# Altium project Kasli-SOC.PrjPcb (part 2 of 11)

## Sheet Kasli-SOC_power.SchDoc: SOC
size 420 x 297 mm; Projet: FPGA & ARM SoC FMC Carrier; CheckedBy: G.Kasprowicz; Author: F.Switakowski; CompanyName: WUT ISE; DrawnBy: F.Switakowski; Organization: WUT ISE; Address1: PW ISE; Address2: Nowowiejska 15/19 00-665 Warsaw; Address3: gkasprow@gmail.com; DocumentNumber: 18; Revision: 1; SheetNumber: 18; SheetTotal: 18; ModifiedBy: -; CheckedDate: -; Title2: Power & Caps; DivGrp: WUT ISE; Designer: G.Kasprowicz; ModifiedDate: -; ProjectName: Sensor Box
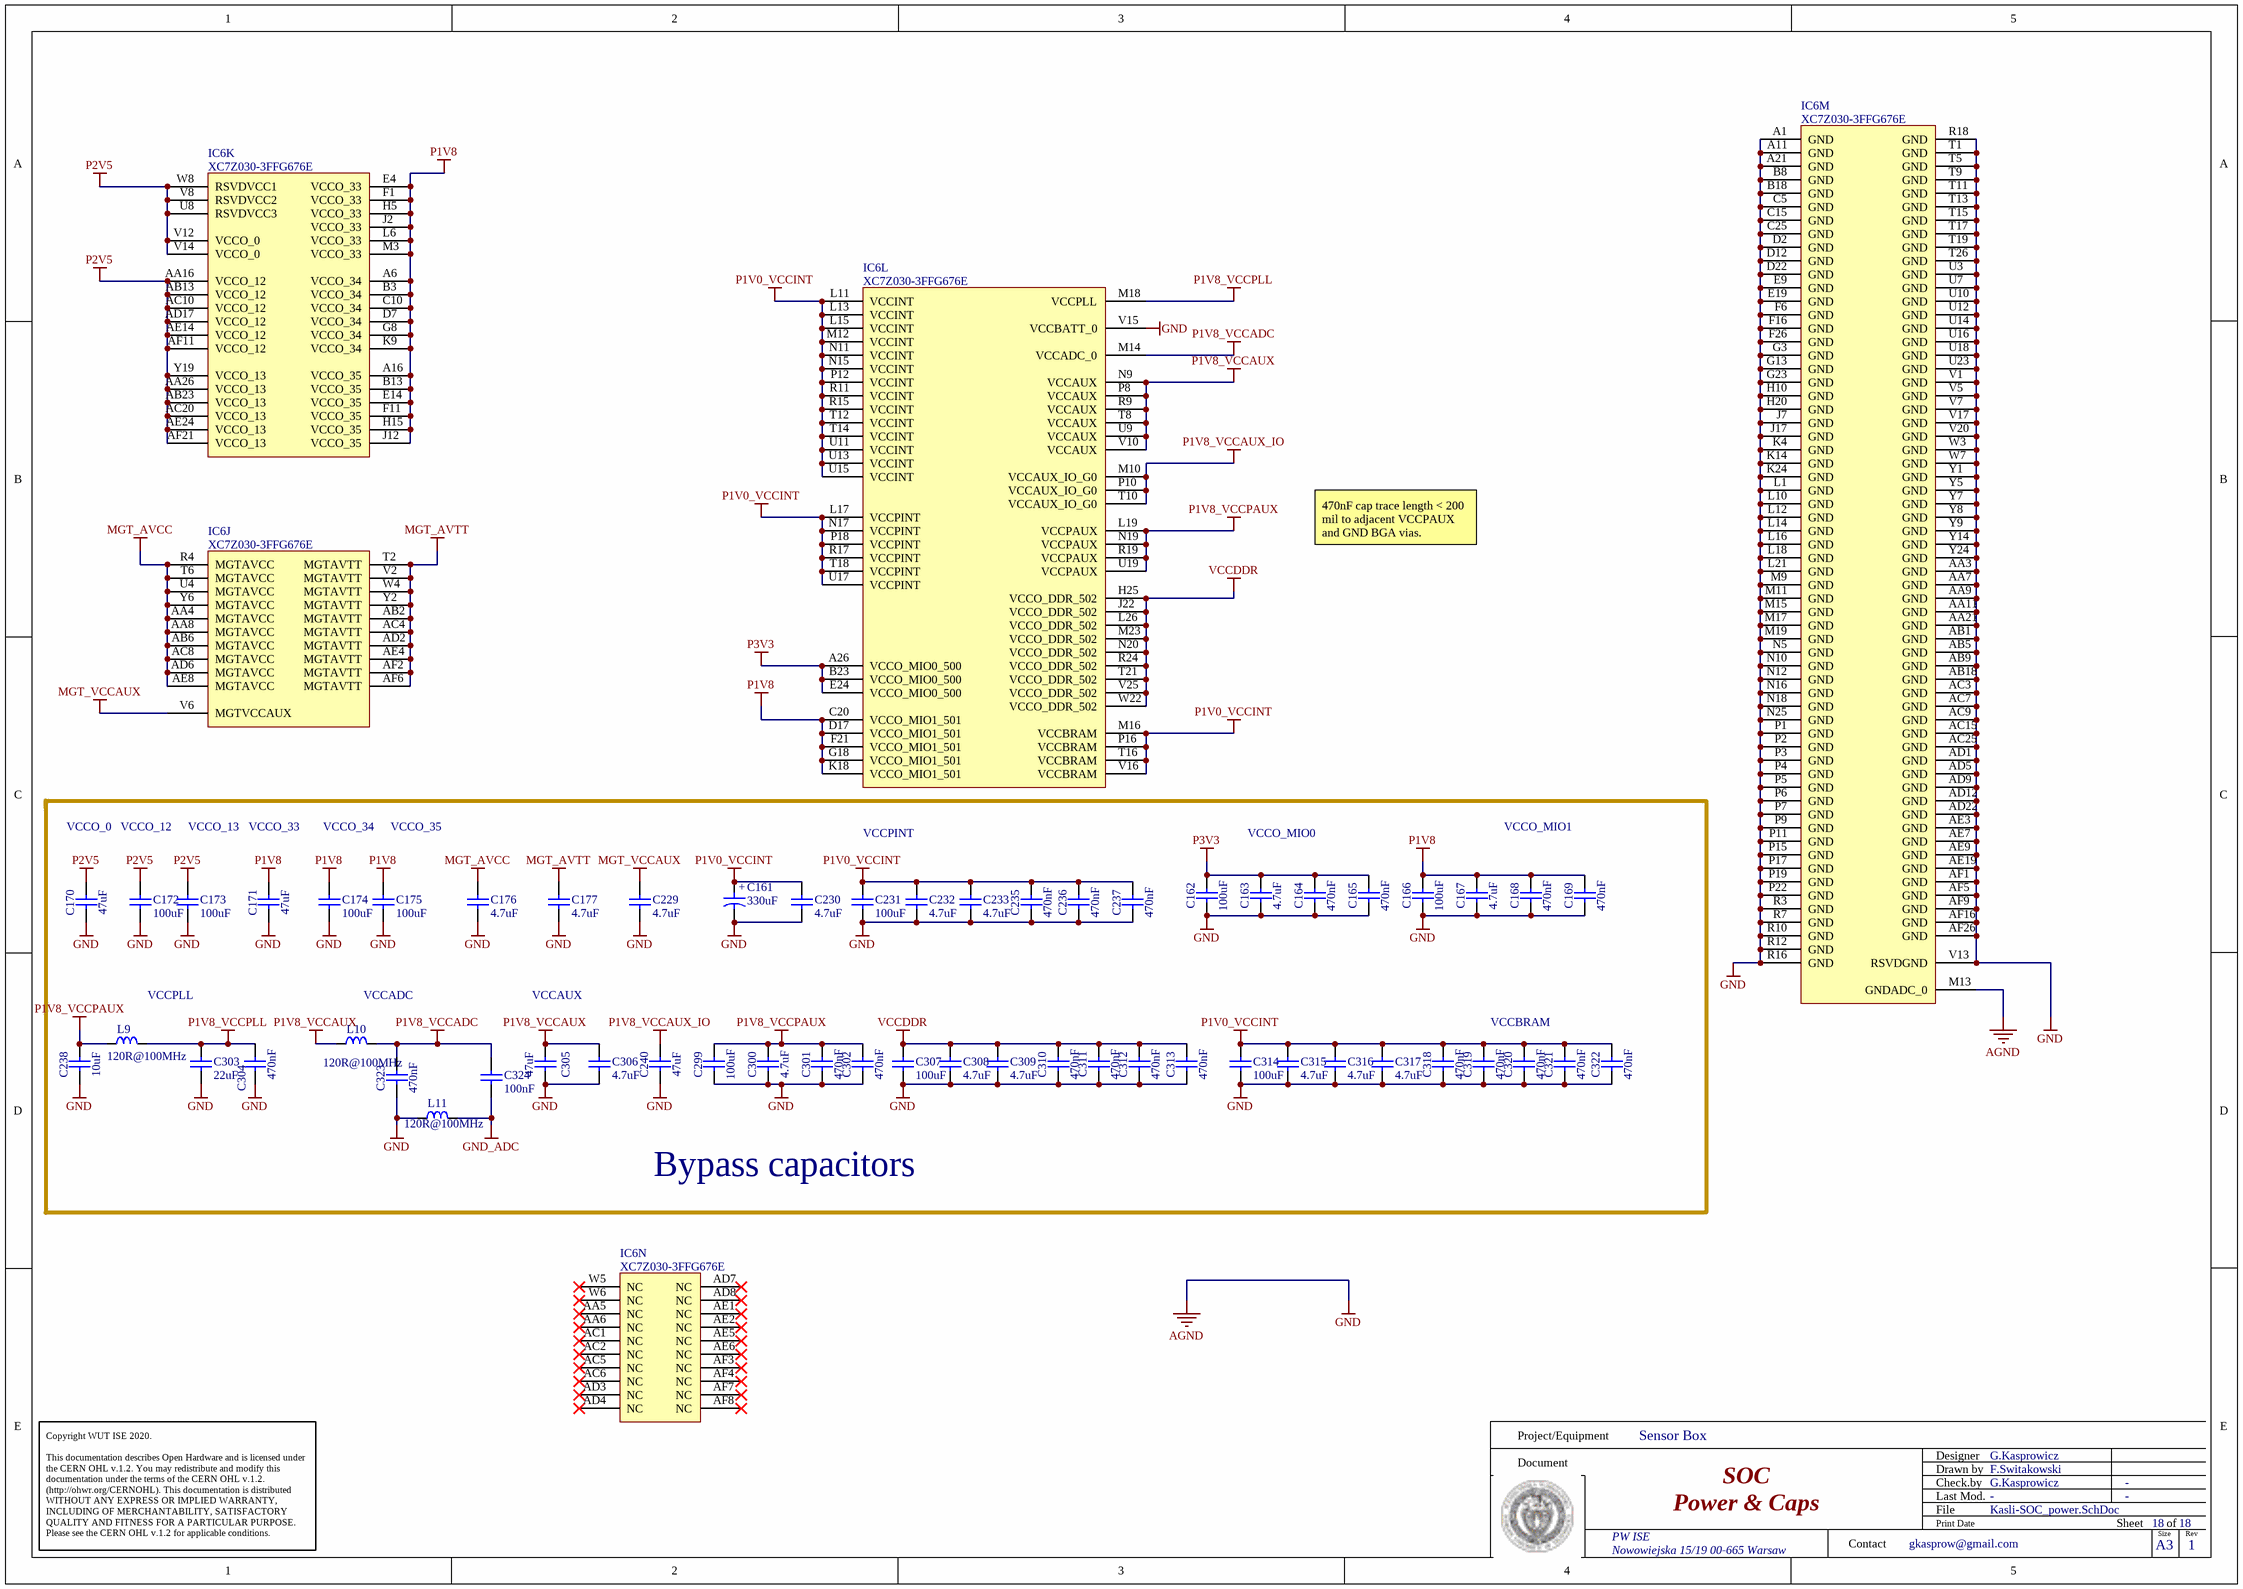
[diagram p3: Kasli-SOC_power.SchDoc]

### Parts
C161  value 330uF  [CAPMP7343X310N]  (hidden comment: 330uF/6.3V/30mR)
C162  100uF  [CAPC3216X180N]
C163  4.7uF  [CAPC1005X55N]
C164  470nF  [CAPC1005X55N]
C165  470nF  [CAPC1005X55N]
C166  100uF  [CAPC3216X180N]
C167  4.7uF  [CAPC1005X55N]
C168  470nF  [CAPC1005X55N]
C169  470nF  [CAPC1005X55N]
C170  47uF  [CAPC3216X180N]
C171  47uF  [CAPC3216X180N]
C172  100uF  [CAPC3216X180N]
C173  100uF  [CAPC3216X180N]
C174  100uF  [CAPC3216X180N]
C175  100uF  [CAPC3216X180N]
C176  4.7uF  [CAPC1608X87N]
C177  4.7uF  [CAPC1608X87N]
C229  4.7uF  [CAPC1608X87N]
C230  4.7uF  [CAPC1608X87N]
C231  100uF  [CAPC3216X180N]
C232  4.7uF  [CAPC1608X87N]
C233  4.7uF  [CAPC1608X87N]
C235  470nF  [CAPC1005X55N]
C236  470nF  [CAPC1005X55N]
C237  470nF  [CAPC1005X55N]
C238  10uF  [CAPC1005X70N]
C240  47uF  [CAPC3216X180N]
C299  100uF  [CAPC3216X180N]
C300  4.7uF  [CAPC1005X55N]
C301  470nF  [CAPC1005X55N]
C302  470nF  [CAPC1005X55N]
C303  22uF  [CAPC3216X180N]
C304  470nF  [CAPC1005X55N]
C305  47uF  [CAPC3216X180N]
C306  4.7uF  [CAPC1608X87N]
C307  100uF  [CAPC3216X180N]
C308  4.7uF  [CAPC1608X87N]
C309  4.7uF  [CAPC1608X87N]
C310  470nF  [CAPC1005X55N]
C311  470nF  [CAPC1005X55N]
C312  470nF  [CAPC1005X55N]
C313  470nF  [CAPC1005X55N]
C314  100uF  [CAPC3216X180N]
C315  4.7uF  [CAPC1608X87N]
C316  4.7uF  [CAPC1608X87N]
C317  4.7uF  [CAPC1608X87N]
C318  470nF  [CAPC1005X55N]
C319  470nF  [CAPC1005X55N]
C320  470nF  [CAPC1005X55N]
C321  470nF  [CAPC1005X55N]
C322  470nF  [CAPC1005X55N]
C323  470nF  [CAPC1005X55N]
C324  100nF  [CAPC1005X55N]
IC6  XC7Z030-3FFG676E  [BGA676C100P26X26_2700X2700X324]  (parts J,K,L,M,N of 14)
L9  120R@100MHz  [INDC1005X55N]
L10  120R@100MHz  [INDC1005X55N]
L11  120R@100MHz  [INDC1005X55N]

### Nets
GND: C161.2 C162.1 C163.1 C164.1 C165.1 C166.1 C167.1 C168.1 C169.1 C170.1 C171.1 C172.2 C173.2 C174.2 C175.2 C176.1 C177.1 C229.1 C230.1 C231.2 C232.1 C233.1 C235.1 C236.1 C237.1 C238.1 C240.1 C299.1 C300.1 C301.1 C302.1 C303.2 C304.1 C305.2 C306.1 C307.2 C308.1 C309.1 C310.1 C311.1 C312.1 C313.1 C314.2 C315.1 C316.1 C317.1 C318.1 C319.1 C320.1 C321.1 C322.1 C323.1 IC6.A1(GND) IC6.A11(GND) IC6.A21(GND) IC6.AA3(GND) IC6.AA7(GND) IC6.AA9(GND) IC6.AA11(GND) IC6.AA21(GND) IC6.AB1(GND) IC6.AB5(GND) IC6.AB9(GND) IC6.AB18(GND) IC6.AC3(GND) IC6.AC7(GND) IC6.AC9(GND) IC6.AC15(GND) IC6.AC25(GND) IC6.AD1(GND) IC6.AD5(GND) IC6.AD9(GND) IC6.AD12(GND) IC6.AD22(GND) IC6.AE3(GND) IC6.AE7(GND) IC6.AE9(GND) IC6.AE19(GND) IC6.AF1(GND) IC6.AF5(GND) IC6.AF9(GND) IC6.AF16(GND) IC6.AF26(GND) IC6.B8(GND) IC6.B18(GND) IC6.C5(GND) IC6.C15(GND) IC6.C25(GND) IC6.D2(GND) IC6.D12(GND) IC6.D22(GND) IC6.E9(GND) IC6.E19(GND) IC6.F6(GND) IC6.F16(GND) IC6.F26(GND) IC6.G3(GND) IC6.G13(GND) IC6.G23(GND) IC6.H10(GND) IC6.H20(GND) IC6.J7(GND) IC6.J17(GND) IC6.K4(GND) IC6.K14(GND) IC6.K24(GND) IC6.L1(GND) IC6.L10(GND) IC6.L12(GND) IC6.L14(GND) IC6.L16(GND) IC6.L18(GND) IC6.L21(GND) IC6.M9(GND) IC6.M11(GND) IC6.M13(GNDADC_0) IC6.M15(GND) IC6.M17(GND) IC6.M19(GND) IC6.N5(GND) IC6.N10(GND) IC6.N12(GND) IC6.N16(GND) IC6.N18(GND) IC6.N25(GND) IC6.P1(GND) IC6.P2(GND) IC6.P3(GND) IC6.P4(GND) IC6.P5(GND) IC6.P6(GND) IC6.P7(GND) IC6.P9(GND) IC6.P11(GND) IC6.P15(GND) IC6.P17(GND) IC6.P19(GND) IC6.P22(GND) IC6.R3(GND) IC6.R7(GND) IC6.R10(GND) IC6.R12(GND) IC6.R16(GND) IC6.R18(GND) IC6.T1(GND) IC6.T5(GND) IC6.T9(GND) IC6.T11(GND) IC6.T13(GND) IC6.T15(GND) IC6.T17(GND) IC6.T19(GND) IC6.T26(GND) IC6.U3(GND) IC6.U7(GND) IC6.U10(GND) IC6.U12(GND) IC6.U14(GND) IC6.U16(GND) IC6.U18(GND) IC6.U23(GND) IC6.V1(GND) IC6.V5(GND) IC6.V7(GND) IC6.V13(RSVDGND) IC6.V15(VCCBATT_0) IC6.V17(GND) IC6.V20(GND) IC6.W3(GND) IC6.W7(GND) IC6.Y1(GND) IC6.Y5(GND) IC6.Y7(GND) IC6.Y8(GND) IC6.Y9(GND) IC6.Y14(GND) IC6.Y24(GND) L11.1  [also labelled AGND]
GND_ADC: C324.1 L11.2
MGT_AVCC: C176.2 IC6.AA4(MGTAVCC) IC6.AA8(MGTAVCC) IC6.AB6(MGTAVCC) IC6.AC8(MGTAVCC) IC6.AD6(MGTAVCC) IC6.AE8(MGTAVCC) IC6.R4(MGTAVCC) IC6.T6(MGTAVCC) IC6.U4(MGTAVCC) IC6.Y6(MGTAVCC)
MGT_AVTT: C177.2 IC6.AB2(MGTAVTT) IC6.AC4(MGTAVTT) IC6.AD2(MGTAVTT) IC6.AE4(MGTAVTT) IC6.AF2(MGTAVTT) IC6.AF6(MGTAVTT) IC6.T2(MGTAVTT) IC6.V2(MGTAVTT) IC6.W4(MGTAVTT) IC6.Y2(MGTAVTT)
MGT_VCCAUX: C229.2 IC6.V6(MGTVCCAUX)
P1V0_VCCINT: C161.1 C230.2 C231.1 C232.2 C233.2 C235.2 C236.2 C237.2 C314.1 C315.2 C316.2 C317.2 C318.2 C319.2 C320.2 C321.2 C322.2 IC6.L11(VCCINT) IC6.L13(VCCINT) IC6.L15(VCCINT) IC6.L17(VCCPINT) IC6.M12(VCCINT) IC6.M16(VCCBRAM) IC6.N11(VCCINT) IC6.N15(VCCINT) IC6.N17(VCCPINT) IC6.P12(VCCINT) IC6.P16(VCCBRAM) IC6.P18(VCCPINT) IC6.R11(VCCINT) IC6.R15(VCCINT) IC6.R17(VCCPINT) IC6.T12(VCCINT) IC6.T14(VCCINT) IC6.T16(VCCBRAM) IC6.T18(VCCPINT) IC6.U11(VCCINT) IC6.U13(VCCINT) IC6.U15(VCCINT) IC6.U17(VCCPINT) IC6.V16(VCCBRAM)
P1V8: C166.2 C167.2 C168.2 C169.2 C171.2 C174.1 C175.1 IC6.A6(VCCO_34) IC6.A16(VCCO_35) IC6.B3(VCCO_34) IC6.B13(VCCO_35) IC6.C10(VCCO_34) IC6.C20(VCCO_MIO1_501) IC6.D7(VCCO_34) IC6.D17(VCCO_MIO1_501) IC6.E4(VCCO_33) IC6.E14(VCCO_35) IC6.F1(VCCO_33) IC6.F11(VCCO_35) IC6.F21(VCCO_MIO1_501) IC6.G8(VCCO_34) IC6.G18(VCCO_MIO1_501) IC6.H5(VCCO_33) IC6.H15(VCCO_35) IC6.J2(VCCO_33) IC6.J12(VCCO_35) IC6.K9(VCCO_34) IC6.K18(VCCO_MIO1_501) IC6.L6(VCCO_33) IC6.M3(VCCO_33)
P1V8_VCCADC: C323.2 C324.2 IC6.M14(VCCADC_0) L10.2
P1V8_VCCAUX: C305.1 C306.2 IC6.N9(VCCAUX) IC6.P8(VCCAUX) IC6.R9(VCCAUX) IC6.T8(VCCAUX) IC6.U9(VCCAUX) IC6.V10(VCCAUX) L10.1
P1V8_VCCAUX_IO: C240.2 IC6.M10(VCCAUX_IO_G0) IC6.P10(VCCAUX_IO_G0) IC6.T10(VCCAUX_IO_G0)
P1V8_VCCPAUX: C238.2 C299.2 C300.2 C301.2 C302.2 IC6.L19(VCCPAUX) IC6.N19(VCCPAUX) IC6.R19(VCCPAUX) IC6.U19(VCCPAUX) L9.1
P1V8_VCCPLL: C303.1 C304.2 IC6.M18(VCCPLL) L9.2
P2V5: C170.2 C172.1 C173.1 IC6.AA16(VCCO_12) IC6.AA26(VCCO_13) IC6.AB13(VCCO_12) IC6.AB23(VCCO_13) IC6.AC10(VCCO_12) IC6.AC20(VCCO_13) IC6.AD17(VCCO_12) IC6.AE14(VCCO_12) IC6.AE24(VCCO_13) IC6.AF11(VCCO_12) IC6.AF21(VCCO_13) IC6.U8(RSVDVCC3) IC6.V8(RSVDVCC2) IC6.V12(VCCO_0) IC6.V14(VCCO_0) IC6.W8(RSVDVCC1) IC6.Y19(VCCO_13)
P3V3: C162.2 C163.2 C164.2 C165.2 IC6.A26(VCCO_MIO0_500) IC6.B23(VCCO_MIO0_500) IC6.E24(VCCO_MIO0_500)
VCCDDR: C307.1 C308.2 C309.2 C310.2 C311.2 C312.2 C313.2 IC6.H25(VCCO_DDR_502) IC6.J22(VCCO_DDR_502) IC6.L26(VCCO_DDR_502) IC6.M23(VCCO_DDR_502) IC6.N20(VCCO_DDR_502) IC6.R24(VCCO_DDR_502) IC6.T21(VCCO_DDR_502) IC6.V25(VCCO_DDR_502) IC6.W22(VCCO_DDR_502)

Not connected (* = marked no-connect by the designer): IC6 AA5(NC)* AA6(NC)* AC1(NC)* AC2(NC)* AC5(NC)* AC6(NC)* AD3(NC)* AD4(NC)* AD7(NC)* AD8(NC)* AE1(NC)* AE2(NC)* AE5(NC)* AE6(NC)* AF3(NC)* AF4(NC)* AF7(NC)* AF8(NC)* W5(NC)* W6(NC)*

### Notes on the sheet
- 470nF cap trace length < 200 mil to adjacent VCCPAUX and GND BGA vias.
- VCCO_0
- VCCO_12
- VCCO_13
- VCCO_33
- VCCO_34
- VCCO_35
- VCCPINT
- VCCO_MIO0
- VCCO_MIO1
- VCCPLL
- (near L10) VCCADC
- VCCAUX
- VCCBRAM
- Bypass capacitors
- Project/Equipment
- Document
- Designer
- Drawn by
- Check.by
- Copyright WUT ISE 2020.
  This documentation describes Open Hardware and is licensed under the CERN OHL v.1.2. You may redistribute and modify this documentation under the terms of the CERN OHL v.1.2. (http://ohwr.org/CERNOHL). This documentation is distributed WITHOUT ANY EXPRESS OR IMPLIED WARRANTY, INCLUDING OF MERCHANTABILITY, SATISFACTORY QUALITY AND FITNESS FOR A PARTICULAR PURPOSE. Please see the CERN OHL v.1.2 for applicable conditions.
- Contact
- File
- Last Mod.
- Print Date
- Sheet
- Size
- A3
- of
- Rev
- (in symbol CTE7343-31_330UF_6.3V_20%_LESR0015_KEMET_T520) +

### Library data of the parts
C161 = CTE7343-31_330UF_6.3V_20%_LESR0015_KEMET_T520: Polarised capacitor; Part Description: Low ESR 0R015 Tantalum Chip Capacitor; Manufacturer: KEMET; Manufacturer Part Number: T520D337M006ATE015; Voltage: 6.3V; Tolerance: ±20%; Table: Capacitors SMD; Part Number: CTE7343-31_330UF_6.3V_20%_LESR0015_KEMET_T520; Component Kind: Standard; Component Type: Standard; Pin Count: 2; Status: None; Case: D; Mounted: Yes; Socket: No; SMD: Yes; ComponentHeight: 3.1mm; HelpURL: \\cern.ch\dfs\Applications\Altium\Datasheets\CTE-LESR_KEMET_T520.pdf; Author: CERN DEM JLC; CreateDate: 2012-01-11; LatestRevisionDate: 2012-01-11
C162 C166 C299 = CC1206_100UF_6.3V_20%_X5R: Non-polarised capacitor; Part Description: SMD Multilayer Chip Ceramic Capacitor; Manufacturer: GENERIC; Manufacturer1 Part Number: C1206C107M9PACTU; Voltage: 6.3V; TC: X5R; Tolerance: ±10%; Part Number: CC1206_100UF_6.3V_20%_X5R; Component Kind: Standard; Component Type: Standard; Pin Count: 2; Value: 100uF; Status: None; Manufacturer Part Number: CC1206_100UF_6.3V_20%_X5R; Case: 1206; Mounted: Yes; Socket: No; SMD: Yes; Sense: No; Manufacturer1 Example: KEMET; Manufacturer1 ComponentHeight: 1.8mm; HelpURL: \\cern.ch\dfs\Applications\Altium\Datasheets\CC1206_X5R_KEMET.pdf; Author: CERN DEM JLC; CreateDate: 26/09/2012; LatestRevisionDate: 26/09/2012
C163 C167 C300 = CC0402_4.7UF_6.3V_20%_X5R: Non-polarised capacitor; Part Description: SMD Multilayer Chip Ceramic Capacitor; Manufacturer: GENERIC; Manufacturer1 Part Number: C1005X5R0J475M050BC; Voltage: 6.3V; TC: X5R; Tolerance: ±20%; Part Number: CC0402_4.7UF_6.3V_20%_X5R; Component Kind: Standard; Component Type: Standard; Pin Count: 2; Value: 4.7uF; Status: Preferred; Manufacturer Part Number: CC0402_4.7UF_6.3V_20%_X5R; Case: 0402; Mounted: Yes; Socket: No; SMD: Yes; Sense: No; Manufacturer1 Example: TDK; Manufacturer1 ComponentHeight: 0.65mm; HelpURL: \\cern.ch\dfs\Applications\Altium\Datasheets\CC0402_X5R_TDK_C.pdf; Author: CERN DEM JLC; CreateDate: 03/03/2015; LatestRevisionDate: 03/03/2015
C164 C165 C168 C169 C235-C237 C301 C302 C304 C310-C313 C318-C323 = CC0402_470NF_16V_10%_X5R: Non-polarised capacitor; Part Description: SMD Multilayer Chip Ceramic Capacitor; Manufacturer: GENERIC; Manufacturer1 Part Number: C1005X5R1C105KT; Voltage: 16V; TC: X5R; Tolerance: ±10%; Part Number: CC0402_470NF_16V_10%_X5R; Component Kind: Standard; Component Type: Standard; Pin Count: 2; Value: 470nF; Status: Preferred; Manufacturer Part Number: CC0402_470NF_16V_10%_X5R; Case: 0402; Mounted: Yes; Socket: No; SMD: Yes; Sense: No; Manufacturer1 Example: TDK; Manufacturer1 ComponentHeight: 0.55mm; HelpURL: \\cern.ch\dfs\Applications\Altium\Datasheets\CC0402_X5R_TDK_C.pdf; Author: CERN DEM JLC; CreateDate: 10/25/2012; LatestRevisionDate: 10/25/2012
C170 C171 C240 C305 = CC1206_47UF_10V_10%_X5R: Non-polarised capacitor; Part Description: SMD Multilayer Chip Ceramic Capacitor; Manufacturer: GENERIC; Manufacturer1 Part Number: GRM31CR61A476KE15; Voltage: 10V; TC: X5R; Tolerance: ±10%; Part Number: CC1206_47UF_10V_10%_X5R; Component Kind: Standard; Component Type: Standard; Pin Count: 2; Value: 47uF; Status: None; Manufacturer Part Number: CC1206_47UF_10V_10%_X5R; Case: 1206; Mounted: Yes; Socket: No; SMD: Yes; Sense: No; Manufacturer1 Example: MURATA; Manufacturer1 ComponentHeight: 1.8mm; HelpURL: \\cern.ch\dfs\Applications\Altium\Datasheets\CC1206_X5R_MURATA_GRM.pdf; Author: CERN DEM MR; CreateDate: 24/06/2016; LatestRevisionDate: 24/06/2016
C172-C175 C231 C307 C314 = CC1206_100UF_6.3V_20%_X5R: Non-polarised capacitor; Part Description: SMD Multilayer Chip Ceramic Capacitor; Manufacturer: GENERIC; Manufacturer1 Part Number: C1206C107M9PACTU; Voltage: 6.3V; TC: X5R; Tolerance: ±10%; Table: Capacitors SMD; Part Number: CC1206_100UF_6.3V_20%_X5R; Component Kind: Standard; Component Type: Standard; Pin Count: 2; Value: 100uF; Status: None; Manufacturer Part Number: CC1206_100UF_6.3V_20%_X5R; Case: 1206; Mounted: Yes; Socket: No; SMD: Yes; Manufacturer1 Example: KEMET; Manufacturer1 ComponentHeight: 1.8mm; HelpURL: \\cern.ch\dfs\Applications\Altium\Datasheets\CC1206_X5R_KEMET.pdf; Author: CERN DEM JLC; CreateDate: 2012-09-26; LatestRevisionDate: 2012-09-26
C176 C177 C229 C230 C232 C233 C306 C308 C309 C315-C317 = CC0603_4.7UF_6.3V_10%_X5R: Non-polarised capacitor; Part Description: SMD Multilayer Chip Ceramic Capacitor; Manufacturer: GENERIC; Manufacturer1 Part Number: 225520613672; Voltage: 6.3V; TC: X5R; Tolerance: ±10%; Table: Capacitors SMD; Part Number: CC0603_4.7UF_6.3V_10%_X5R; Component Kind: Standard; Component Type: Standard; Pin Count: 2; Value: 4.7uF; Status: Preferred; Manufacturer Part Number: CC0603_4.7uF_6.3V_10%_X5R; Case: 0603; Mounted: Yes; Socket: No; SMD: Yes; Manufacturer1 Example: PHYCOMP; Manufacturer1 ComponentHeight: 0.87mm; HelpURL: \\cern.ch\dfs\Applications\Altium\Datasheets\CC0805_X5R_PHYCOMP_HC.pdf; Author: CERN DEM JLC; CreateDate: 2007-12-03; LatestRevisionDate: 2007-12-03
C238 = CC0402_10UF_6.3V_20%_X5R: Non-polarised capacitor; Part Description: SMD Multilayer Chip Ceramic Capacitor; Manufacturer: GENERIC; Manufacturer1 Part Number: C1005X5R0J106M050BC; Voltage: 6.3V; TC: X5R; Tolerance: ±10%; Part Number: CC0402_10UF_6.3V_20%_X5R; Component Kind: Standard; Component Type: Standard; Pin Count: 2; Value: 10uF; Status: Preferred; Manufacturer Part Number: CC0402_10UF_6.3V_20%_X5R; Case: 0402; Mounted: Yes; Socket: No; SMD: Yes; Sense: No; Manufacturer1 Example: TDK; Manufacturer1 ComponentHeight: 0.70mm; HelpURL: \\cern.ch\dfs\Applications\Altium\Datasheets\CC0402_X5R_TDK_C.pdf; Author: CERN DEM JLC; CreateDate: 07.01.2015; LatestRevisionDate: 07.01.2015
C303 = CC1206_22UF_10V_10%_X7R: Non-polarised capacitor; Part Description: SMD Multilayer Chip Ceramic Capacitor; Manufacturer: GENERIC; Manufacturer1 Part Number: GRM31CR71A226KE15L; Voltage: 10V; TC: X7R; Tolerance: ±10%; Table: Capacitors SMD; Value: 22uF; Part Number: CC1206_22UF_10V_10%_X7R; Component Kind: Standard; Component Type: Standard; Pin Count: 2; Status: Preferred; Manufacturer Part Number: CC1206_22UF_10V_10%_X7R; Case: 1206; Mounted: Yes; Socket: No; SMD: Yes; Manufacturer1 Example: MURATA; Manufacturer1 ComponentHeight: 1.8mm; HelpURL: \\cern.ch\dfs\Applications\Altium\Datasheets\CC1206_X7R_MURATA_GRM-HI-CAP.pdf; Author: CERN DEM JLC; CreateDate: 2010-06-08; LatestRevisionDate: 2010-06-08
C324 = CC0402_100NF_16V_10%_X7R: Non-polarised capacitor; Part Description: SMD Multilayer Chip Ceramic Capacitor; Manufacturer: GENERIC; Manufacturer1 Part Number: GRM155R71C104KA88D; Voltage: 16V; TC: X7R; Tolerance: ±10%; Table: Capacitors SMD; Part Number: CC0402_100NF_16V_10%_X7R; Component Kind: Standard; Component Type: Standard; Pin Count: 2; Value: 100nF; Status: Not Recommended; Manufacturer Part Number: CC0402_100NF_16V_10%_X7R; Case: 0402; Mounted: Yes; Socket: No; SMD: Yes; Manufacturer1 Example: MURATA; Manufacturer1 ComponentHeight: 0.55mm; HelpURL: \\cern.ch\dfs\Applications\Altium\Datasheets\CC0402_X7R_MURATA_GRM.pdf; Author: CERN DEM JLC; CreateDate: 2013-12-05; LatestRevisionDate: 2007-12-03
IC6 = XC7Z030-2FFG676I: 733 MHz Zynq™-7000 AP SoC, 130 PS I/O, 254 FPGA I/O, 676-Ball BGA, Speed Grade 2, Industrial Grade, Pb-Free; Part Description: Zynq™-7000 All Programmable SoC, Dual-core ARM® Cortex™-A9 CPU, 676-Ball BGA, Speed Grade 2, Industrial Grade, Pb-Free; Manufacturer: XILINX; PressFit: No; Bonding: No; Part Number: XC7Z030-3FFG676E; Component Kind: Standard; Component Type: Standard; Device: XC7Z030-2FFG676I; PackageDescription: BGA, 1.00mm Pitch, Square; 676 Pin, 26 Columns X 26 Rows, 27.00mm X 27.00mm X 2.60mm H; Manufacturer Part Number: XC7Z030-3FFG676E; Pin Count: 676; Case: BGA676; Mounted: Yes; Socket: No; SMD: Yes; Sense: No; ComponentHeight: 3.24mm; HelpURL: \\cern.ch\dfs\Applications\Altium\Datasheets\XC7Z030-2FFG676I.pdf; ComponentLink1URL: \\cern.ch\dfs\Applications\Altium\Datasheets\XC7Z030-2FFG676I_Package.pdf; ComponentLink1Description: Package; ComponentLink2URL: \\cern.ch\dfs\Applications\Altium\Datasheets\XC7Z030-2FFG676I_Pinout.txt; ComponentLink2Description: Pinout; Author: CERN DEM JLC; CreateDate: 29/04/2014; LatestRevisionDate: 29/04/2014
L9-L11 = IND0402_MURATA_BLM15PX121SN1D: Inductor; Part Description: SMD EMIFIL Chip Ferrite Bead; Manufacturer: MURATA; Power: 2A; Resistance: 0.055R; Tolerance: ±25%; Table: Inductors SMD; Part Number: IND0402_MURATA_BLM15PX121SN1D; Component Kind: Standard; Component Type: Standard; Pin Count: 2; Value: 120R@100MHz; Status: None; Manufacturer Part Number: BLM15PX121SN1D; Case: 0402; Mounted: Yes; Socket: No; SMD: Yes; ComponentHeight: 0.55mm; HelpURL: \\cern.ch\dfs\Applications\Altium\Datasheets\IND0402_MURATA_BLM15PX.pdf; Author: CERN DEM JMW; CreateDate: 2014-02-19; LatestRevisionDate: 2014-02-19

## Sheet Kasli-SOC_bank112.SchDoc: MGT
size 420 x 297 mm; CheckedBy: G.Kasprowicz; Author: F.Switakowski; CompanyName: WUT ISE; DrawnBy: F.Switakowski; Organization: WUT ISE; Address1: PW ISE; Address2: Nowowiejska 15/19 00-665 Warsaw; Address3: gkasprow@gmail.com; DocumentNumber: 5; Revision: 1; SheetNumber: 5; SheetTotal: 18; ModifiedBy: -; CheckedDate: -; Title2: & clock; DivGrp: WUT ISE; Designer: G.Kasprowicz; ModifiedDate: -; ProjectName: Sensor Box
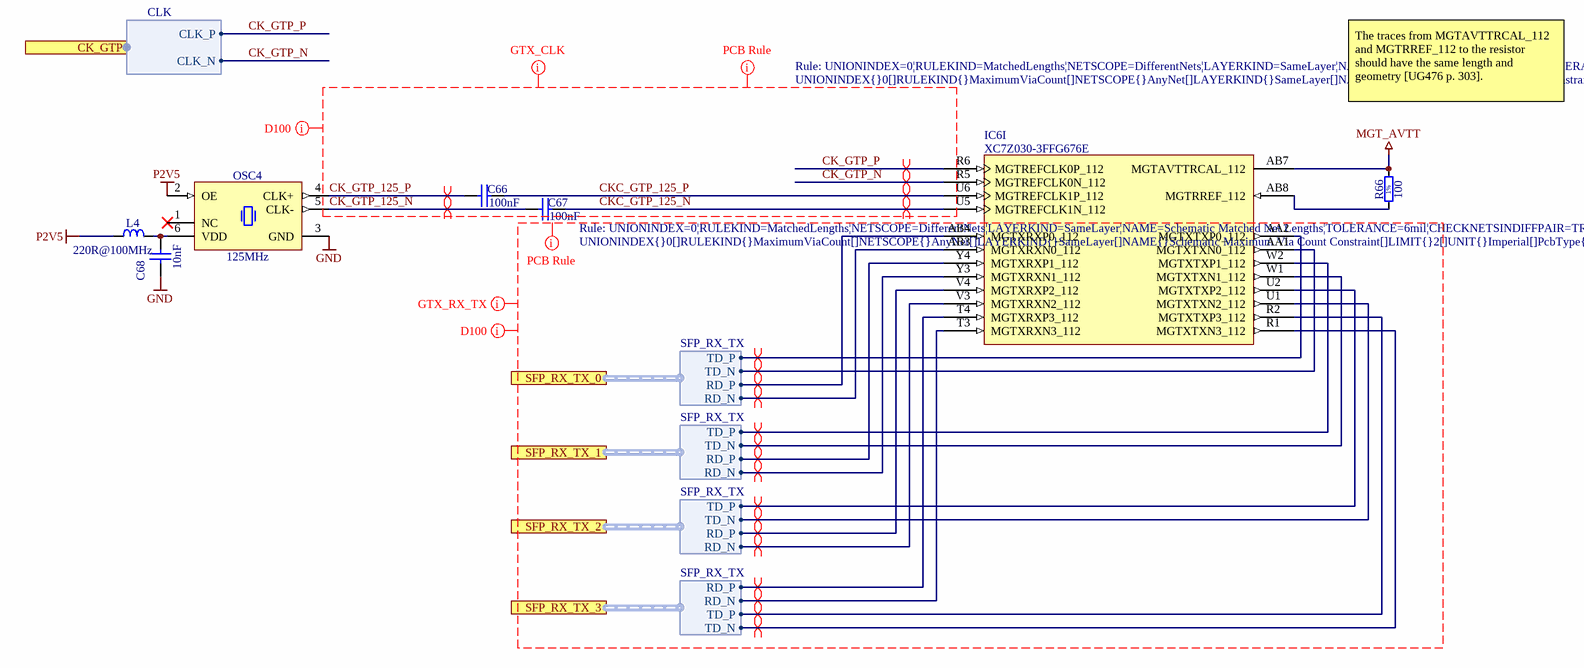
[diagram p4: Kasli-SOC_bank112.SchDoc]

### Parts
C66  100nF  [CAPC0603X33N]
C67  100nF  [CAPC0603X33N]
C68  10nF  [CAPC1005X55N]
IC6  XC7Z030-3FFG676E  [BGA676C100P26X26_2700X2700X324]  (part I of 14)
L4  220R@100MHz  [INDC2012X105N]
OSC4  125MHz  [OSC_SILICON-LAB_SI510-6N(5X7)]
R66  100  [RESC0603X28N]

### Ports
CK_GTP (harness CLK), SFP_RX_TX_0 (harness SFP_RX_TX), SFP_RX_TX_1 (harness SFP_RX_TX), SFP_RX_TX_2 (harness SFP_RX_TX), SFP_RX_TX_3 (harness SFP_RX_TX)

### Harnesses
SFP_RX_TX: RD_N, RD_P, TD_N, TD_P
CLK: CLK_P, CLK_N

### Nets
GND: C68.1 OSC4.3(GND)
MGT_AVTT: IC6.AB7(MGTAVTTRCAL_112) R66.2
P2V5: L4.1 OSC4.2(OE)
CK_GTP_125_N: C67.1 OSC4.5(CLK-)
CK_GTP_125_P: C66.1 OSC4.4(CLK+)
CK_GTP_N: IC6.R5(MGTREFCLK0N_112) ; port CK_GTP.CLK_N
CK_GTP_P: IC6.R6(MGTREFCLK0P_112) ; port CK_GTP.CLK_P
CKC_GTP_125_N: C67.2 IC6.U5(MGTREFCLK1N_112)
CKC_GTP_125_P: C66.2 IC6.U6(MGTREFCLK1P_112)
SFP0_RD_N: IC6.AB3(MGTXRXN0_112) ; port SFP_RX_TX_0.RD_N
SFP0_RD_P: IC6.AB4(MGTXRXP0_112) ; port SFP_RX_TX_0.RD_P
SFP0_TD_N: IC6.AA1(MGTXTXN0_112) ; port SFP_RX_TX_0.TD_N
SFP0_TD_P: IC6.AA2(MGTXTXP0_112) ; port SFP_RX_TX_0.TD_P
SFP1_RD_N: IC6.Y3(MGTXRXN1_112) ; port SFP_RX_TX_1.RD_N
SFP1_RD_P: IC6.Y4(MGTXRXP1_112) ; port SFP_RX_TX_1.RD_P
SFP1_TD_N: IC6.W1(MGTXTXN1_112) ; port SFP_RX_TX_1.TD_N
SFP1_TD_P: IC6.W2(MGTXTXP1_112) ; port SFP_RX_TX_1.TD_P
SFP2_RD_N: IC6.V3(MGTXRXN2_112) ; port SFP_RX_TX_2.RD_N
SFP2_RD_P: IC6.V4(MGTXRXP2_112) ; port SFP_RX_TX_2.RD_P
SFP2_TD_N: IC6.U1(MGTXTXN2_112) ; port SFP_RX_TX_2.TD_N
SFP2_TD_P: IC6.U2(MGTXTXP2_112) ; port SFP_RX_TX_2.TD_P
SFP3_RD_N: IC6.T3(MGTXRXN3_112) ; port SFP_RX_TX_3.RD_N
SFP3_RD_P: IC6.T4(MGTXRXP3_112) ; port SFP_RX_TX_3.RD_P
SFP3_TD_N: IC6.R1(MGTXTXN3_112) ; port SFP_RX_TX_3.TD_N
SFP3_TD_P: IC6.R2(MGTXTXP3_112) ; port SFP_RX_TX_3.TD_P
NetC68_2: C68.2 L4.2 OSC4.6(VDD)
NetIC6_AB8: IC6.AB8(MGTRREF_112) R66.1

Not connected (* = marked no-connect by the designer): OSC4 1(NC)*

### Layout directives
net class GTX_RXTX: (no net found under the mark)
rule Matched Net Lengths [Tolerance = 0.152mm]; rule Maximum Via Count Constraint [Max Count = 2]: (no net found under the mark)
net class GTX_CLK: CK_GTP_125_N, CK_GTP_125_P, CK_GTP_N, CK_GTP_P, CKC_GTP_125_N, CKC_GTP_125_P
rule Matched Net Lengths [Tolerance = 1.575mm]; rule Maximum Via Count Constraint [Max Count = 2]: CK_GTP_125_N, CK_GTP_125_P, CK_GTP_N, CK_GTP_P, CKC_GTP_125_N, CKC_GTP_125_P
differential pair; differential pair class Diff_100Ohm; differential pair class GTP: SFP0_RD_N, SFP0_RD_P, SFP0_TD_N, SFP0_TD_P, SFP1_RD_N, SFP1_RD_P, SFP1_TD_N, SFP1_TD_P, SFP2_RD_N, SFP2_RD_P, SFP2_TD_N, SFP2_TD_P, SFP3_RD_N, SFP3_RD_P, SFP3_TD_N, SFP3_TD_P
differential pair; differential pair class LVPECL: CK_GTP_N, CK_GTP_P
differential pair; differential pair class Diff_100Ohm: CK_GTP_125_N, CK_GTP_125_P, CKC_GTP_125_N, CKC_GTP_125_P
net class D100: (no net found under the mark), CK_GTP_125_N, CK_GTP_125_P, CK_GTP_N, CK_GTP_P, CKC_GTP_125_N, CKC_GTP_125_P

### Notes on the sheet
- The traces from MGTAVTTRCAL_112 and MGTRREF_112 to the resistor should have the same length and geometry [UG476 p. 303].
- Project/Equipment
- Document
- Designer
- Drawn by
- Check.by
- Copyright WUT ISE 2020.
  This documentation describes Open Hardware and is licensed under the CERN OHL v.1.2. You may redistribute and modify this documentation under the terms of the CERN OHL v.1.2. (http://ohwr.org/CERNOHL). This documentation is distributed WITHOUT ANY EXPRESS OR IMPLIED WARRANTY, INCLUDING OF MERCHANTABILITY, SATISFACTORY QUALITY AND FITNESS FOR A PARTICULAR PURPOSE. Please see the CERN OHL v.1.2 for applicable conditions.
- Contact
- File
- Last Mod.
- Print Date
- Sheet
- Size
- A3
- of
- Rev
- (in symbol R0201_100R_1%_0.05W_200PPM) 1%

### Library data of the parts
C66 C67 = CC0201_100NF_6.3V_10%_X5R: Non-polarised capacitor; Part Description: SMD Multilayer Chip Ceramic Capacitor; Manufacturer: GENERIC; Manufacturer1 Part Number: 02016D104KAT2A; Voltage: 6.3V; TC: X5R; Tolerance: ±10%; Part Number: CC0201_100NF_6.3V_10%_X5R; Component Kind: Standard; Component Type: Standard; Pin Count: 2; Value: 100nF; Status: Not Recommended; Manufacturer Part Number: CC0201_100NF_6.3V_10%_X5R; Case: 0201; Mounted: Yes; Socket: No; SMD: Yes; Sense: No; Manufacturer1 Example: AVX; Manufacturer1 ComponentHeight: 0.33mm; HelpURL: \\cern.ch\dfs\Applications\Altium\Datasheets\CC0201_X5R_AVX.pdf; Author: CERN DEM JLC; CreateDate: 2007-12-03; LatestRevisionDate: 2007-12-03
C68 = CC0402_10NF_16V_10%_X7R: Non-polarised capacitor; Part Description: SMD Multilayer Chip Ceramic Capacitor; Manufacturer: GENERIC; Manufacturer1 Part Number: 223878715636; Voltage: 16V; TC: X7R; Tolerance: ±10%; Part Number: CC0402_10NF_16V_10%_X7R; Component Kind: Standard; Component Type: Standard; Pin Count: 2; Value: 10nF; Status: Not Recommended; Manufacturer Part Number: CC0402_10NF_16V_10%_X7R; Case: 0402; Mounted: Yes; Socket: No; SMD: Yes; Sense: No; Manufacturer1 Example: PHYCOMP; Manufacturer1 ComponentHeight: 0.55mm; HelpURL: \\cern.ch\dfs\Applications\Altium\Datasheets\CC0402_X7R_PHYCOMP.pdf; Author: CERN DEM JLC; CreateDate: 03.12.2007; LatestRevisionDate: 03.12.2007
IC6 = XC7Z030-2FFG676I: as IC6 on sheet Kasli-SOC_power; Part Number: XC7Z030-3FFG676E; Component Kind: Standard; Component Type: Standard; Device: XC7Z030-2FFG676I; PackageDescription: BGA, 1.00mm Pitch, Square; 676 Pin, 26 Columns X 26 Rows, 27.00mm X 27.00mm X 2.60mm H; Manufacturer Part Number: XC7Z030-3FFG676E; Pin Count: 676; Case: BGA676; Mounted: Yes; Socket: No; SMD: Yes; Sense: No; ComponentHeight: 3.24mm; HelpURL: \\cern.ch\dfs\Applications\Altium\Datasheets\XC7Z030-2FFG676I.pdf; ComponentLink1URL: \\cern.ch\dfs\Applications\Altium\Datasheets\XC7Z030-2FFG676I_Package.pdf; ComponentLink1Description: Package; ComponentLink2URL: \\cern.ch\dfs\Applications\Altium\Datasheets\XC7Z030-2FFG676I_Pinout.txt; ComponentLink2Description: Pinout; Author: CERN DEM JLC; CreateDate: 29/04/2014; LatestRevisionDate: 29/04/2014
L4 = IND0805_MURATA_BLM21PG221SN1D: Inductor; Part Description: SMD EMIFIL Suppression Chip Ferrite Bead; Manufacturer: MURATA; Power: 2A; Resistance: 0.05R; Tolerance: ±25%; Part Number: IND0805_MURATA_BLM21PG221SN1D; Component Kind: Standard; Component Type: Standard; Pin Count: 2; Value: 220R@100MHz; Status: None; Manufacturer Part Number: BLM21PG221SN1D; Case: 0805; Mounted: Yes; Socket: No; SMD: Yes; Sense: No; ComponentHeight: 1.05mm; HelpURL: \\cern.ch\dfs\Applications\Altium\Datasheets\IND0805_MURATA_BLM21P.pdf; Author: CERN DEM JLC; CreateDate: 25/01/2010; LatestRevisionDate: 25/01/2010
OSC4 = OSC_125MHZ_SILICON-LAB_510FBA125M000AAG: Crystal Oscillator 6 pins, Si510 (LVDS/LVPECL/HCSL/Dual CMOS); Part Description: 2.5V ±25ppm LVDS Crystal Oscillator (XO), Si510 Series; Manufacturer: SILICON LABS; PressFit: No; Bonding: No; Part Number: OSC_125MHZ_SILICON-LAB_510FBA125M000AAG; Component Kind: Standard; Component Type: Standard; PackageDescription: Oscillator Si510 Series, 6 pins, 5x7mm; Value: 125MHz; Manufacturer Part Number: 510FBA125M000AAG; Pin Count: 6; Mounted: Yes; Socket: No; SMD: Yes; Sense: No; ComponentHeight: 1.8mm; HelpURL: \\cern.ch\dfs\Applications\Altium\Datasheets\OSC_SILICON-LAB_SI510.pdf; Author: CERN DEM JMW; CreateDate: 10.08.2015; LatestRevisionDate: 26.11.2018
R66 = R0201_100R_1%_0.05W_200PPM: Resistor - 1%; Part Description: Thick Film Chip Resistor; Manufacturer: GENERIC; Manufacturer1 Part Number: CRCW0201100RFNED; Power: 0.05W; TC: ±200ppm/°C; PressFit: No; Part Number: R0201_100R_1%_0.05W_200PPM; Component Kind: Standard; Component Type: Standard; Pin Count: 2; Value: 100; Status: Not Recommended; Tolerance: ±1%; Manufacturer Part Number: R0201_100R_1%_0.05W_200PPM; Case: 0201; Mounted: Yes; Sense: No; Socket: No; SMD: Yes; Manufacturer1 Example: VISHAY; Manufacturer1 ComponentHeight: 0.27mm; HelpURL: \\cern.ch\dfs\Applications\Altium\Datasheets\R0201_VISHAY_CRCW0201 e3.pdf; Author: CERN DEM JLC; CreateDate: 13.11.2014; LatestRevisionDate: 13.11.2014